# Altium schematic sheet Relay-Switch.SchDoc (part 1 of 2)
size A; SheetNumber: 5; SheetTotal: 5
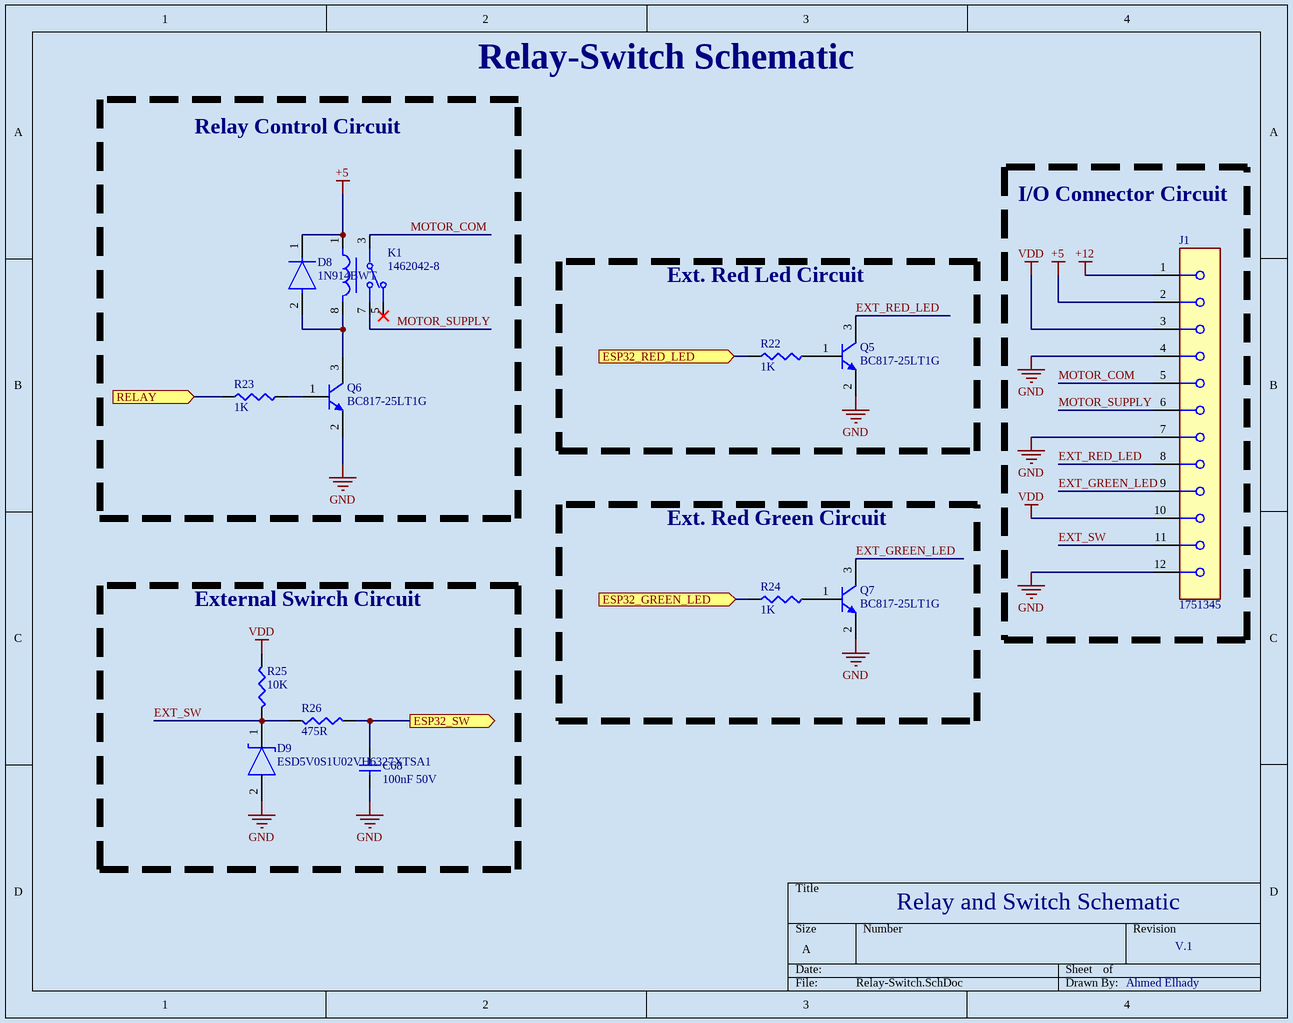
[diagram p0: Relay-Switch.SchDoc]

## Parts
C68  100nF 50V  [0603 (1608 Metric)-CAP-100NF-50V]
D8  1N914BWT  [1N914BWT_dIODE_smd_ON_Semiconductor_502-01_MFG]
D9  ESD5V0S1U02VH6327XTSA1  [tvs_diode_Infineon_PG-SC79-2_MFG]
J1  1751345  [Terminal_Block_12pin_screw_Phoenix_Contact_1751345_0]
K1  1462042-8  [RELAY_SPDT_TE_1462042-8_0]
Q5  BC817-25LT1G  [transitor_npn_ONSC-SOT-23-3-318-08_V]
Q6  BC817-25LT1G  [transitor_npn_ONSC-SOT-23-3-318-08_V]
Q7  BC817-25LT1G  [transitor_npn_ONSC-SOT-23-3-318-08_V]
R22  1K  [1K_0603_KOA_Speer_RK73B1J_MFG]
R23  1K  [1K_0603_KOA_Speer_RK73B1J_MFG]
R24  1K  [1K_0603_KOA_Speer_RK73B1J_MFG]
R25  10K  [YAGEO-0603-10K-0.1W]
R26  475R  [475R_0603_Panasonic_ERJ3EK_MFG]

## Blocks framed on the sheet
Relay Control Circuit: D8 K1 Q6 R23
I/O Connector Circuit: J1
Ext. Red Led Circuit: Q5 R22
Ext. Red Green Circuit: Q7 R24
External Swirch Circuit: C68 D9 R25 R26

## Ports
ESP32_GREEN_LED (in, see Main Block Diagram[2C], ESP32-Main[3A]), ESP32_RED_LED (in, see Main Block Diagram[2C], ESP32-Main[3A]), ESP32_SW (out, see Main Block Diagram[2C], ESP32-Main[3B]), RELAY (in, see Main Block Diagram[2C], ESP32-Main[3A])

## Nets
+5: D8.1(CATHODE) J1.2 K1.1
+12: J1.1
GND: C68.1 D9.2(ANODE) J1.4 J1.7 J1.12 Q5.2(E) Q6.2(E) Q7.2(E)
VDD: J1.3 J1.10 R25.2
ESP32_GREEN_LED: R24.2 ; port ESP32_GREEN_LED
ESP32_RED_LED: R22.2 ; port ESP32_RED_LED
ESP32_SW: C68.2 R26.2 ; port ESP32_SW
EXT_GREEN_LED: J1.9 Q7.3(C)
EXT_RED_LED: J1.8 Q5.3(C)
EXT_SW: D9.1(CATHODE) J1.11 R25.1 R26.1
MOTOR_COM: J1.5 K1.3
MOTOR_SUPPLY: J1.6 K1.7
RELAY: R23.2 ; port RELAY
NetD8_2: D8.2(ANODE) K1.8 Q6.3(C)
NetQ5_1: Q5.1(B) R22.1
NetQ6_1: Q6.1(B) R23.1
NetQ7_1: Q7.1(B) R24.1

Not connected (* = marked no-connect by the designer): K1 5*

## Notes on the sheet
- Relay-Switch Schematic
- Relay and Switch Schematic
- V.1
- Ahmed Elhady